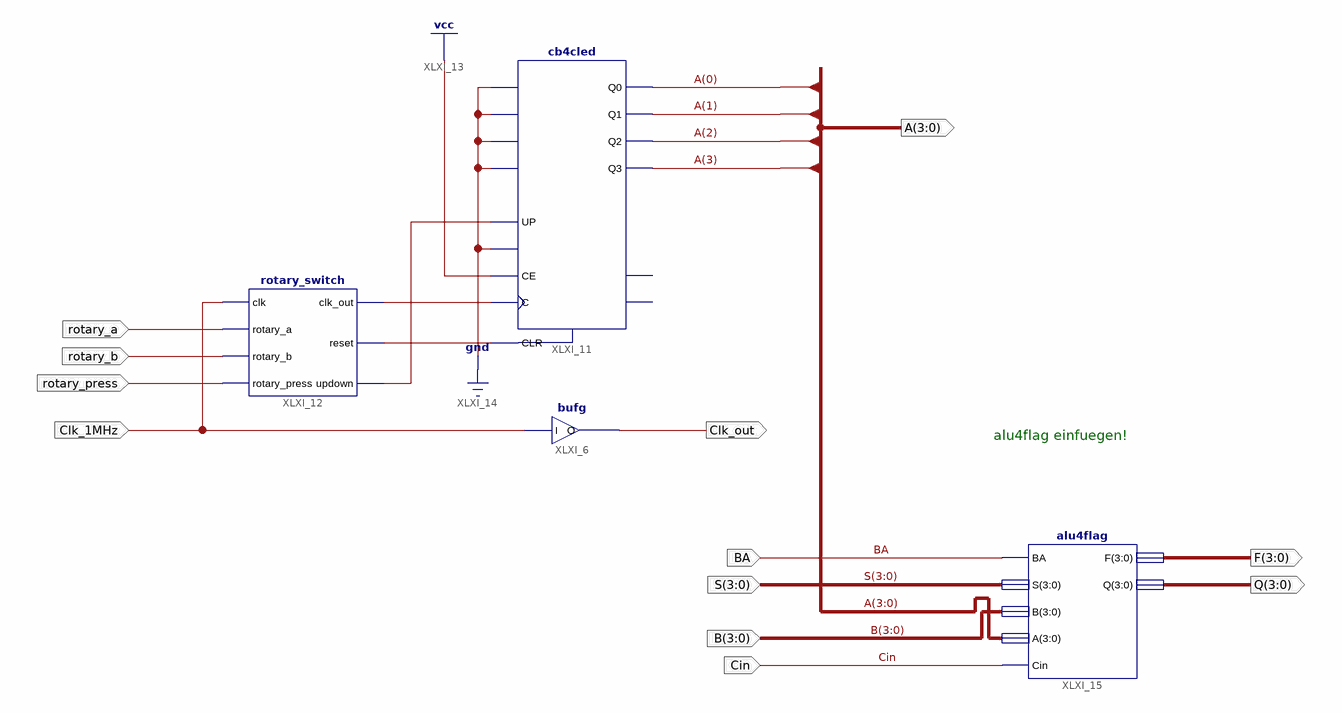
[diagram p0: schematic sheet 1]
// Xilinx ISE schematic board_alu4flag.sch (spartan3e) as structural Verilog: 4 symbols, 12 ports
module board_alu4flag (
  input  BA,
  input  [3:0] S,
  input  Cin,
  input  [3:0] B,
  input  Clk_1MHz,
  input  rotary_a,
  input  rotary_b,
  input  rotary_press,
  output [3:0] Q,
  output [3:0] A,
  output [3:0] F,
  output Clk_out
);

  wire XLXN_13, XLXN_14, XLXN_15;

  bufg XLXI_6 (.I(Clk_1MHz), .O(Clk_out));
  cb4cled XLXI_11 (
    .C(XLXN_15), .CE(1'b1), .CLR(XLXN_13), .D0(1'b0), .D1(1'b0), .D2(1'b0), .D3(1'b0), .L(1'b0),
    .UP(XLXN_14), .Q0(A[0]), .Q1(A[1]), .Q2(A[2]), .Q3(A[3]));  // open: CEO, TC
  rotary_switch XLXI_12 (
    .clk(Clk_1MHz), .rotary_a(rotary_a), .rotary_b(rotary_b), .rotary_press(rotary_press), .clk_out(XLXN_15),
    .reset(XLXN_13), .updown(XLXN_14));
  alu4flag XLXI_15 (.A(A), .B(B), .BA(BA), .Cin(Cin), .F(F), .Q(Q), .S(S));

  // Notes on the sheet:
  //   alu4flag einfuegen!
endmodule
